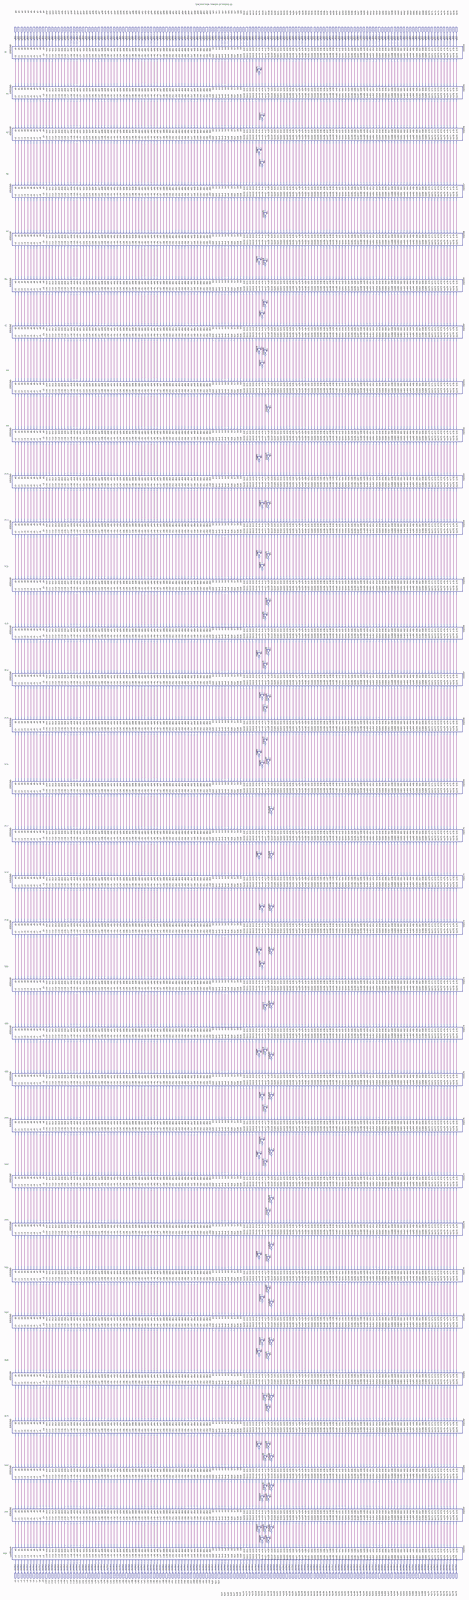
[diagram p0: schematic sheet, whole]
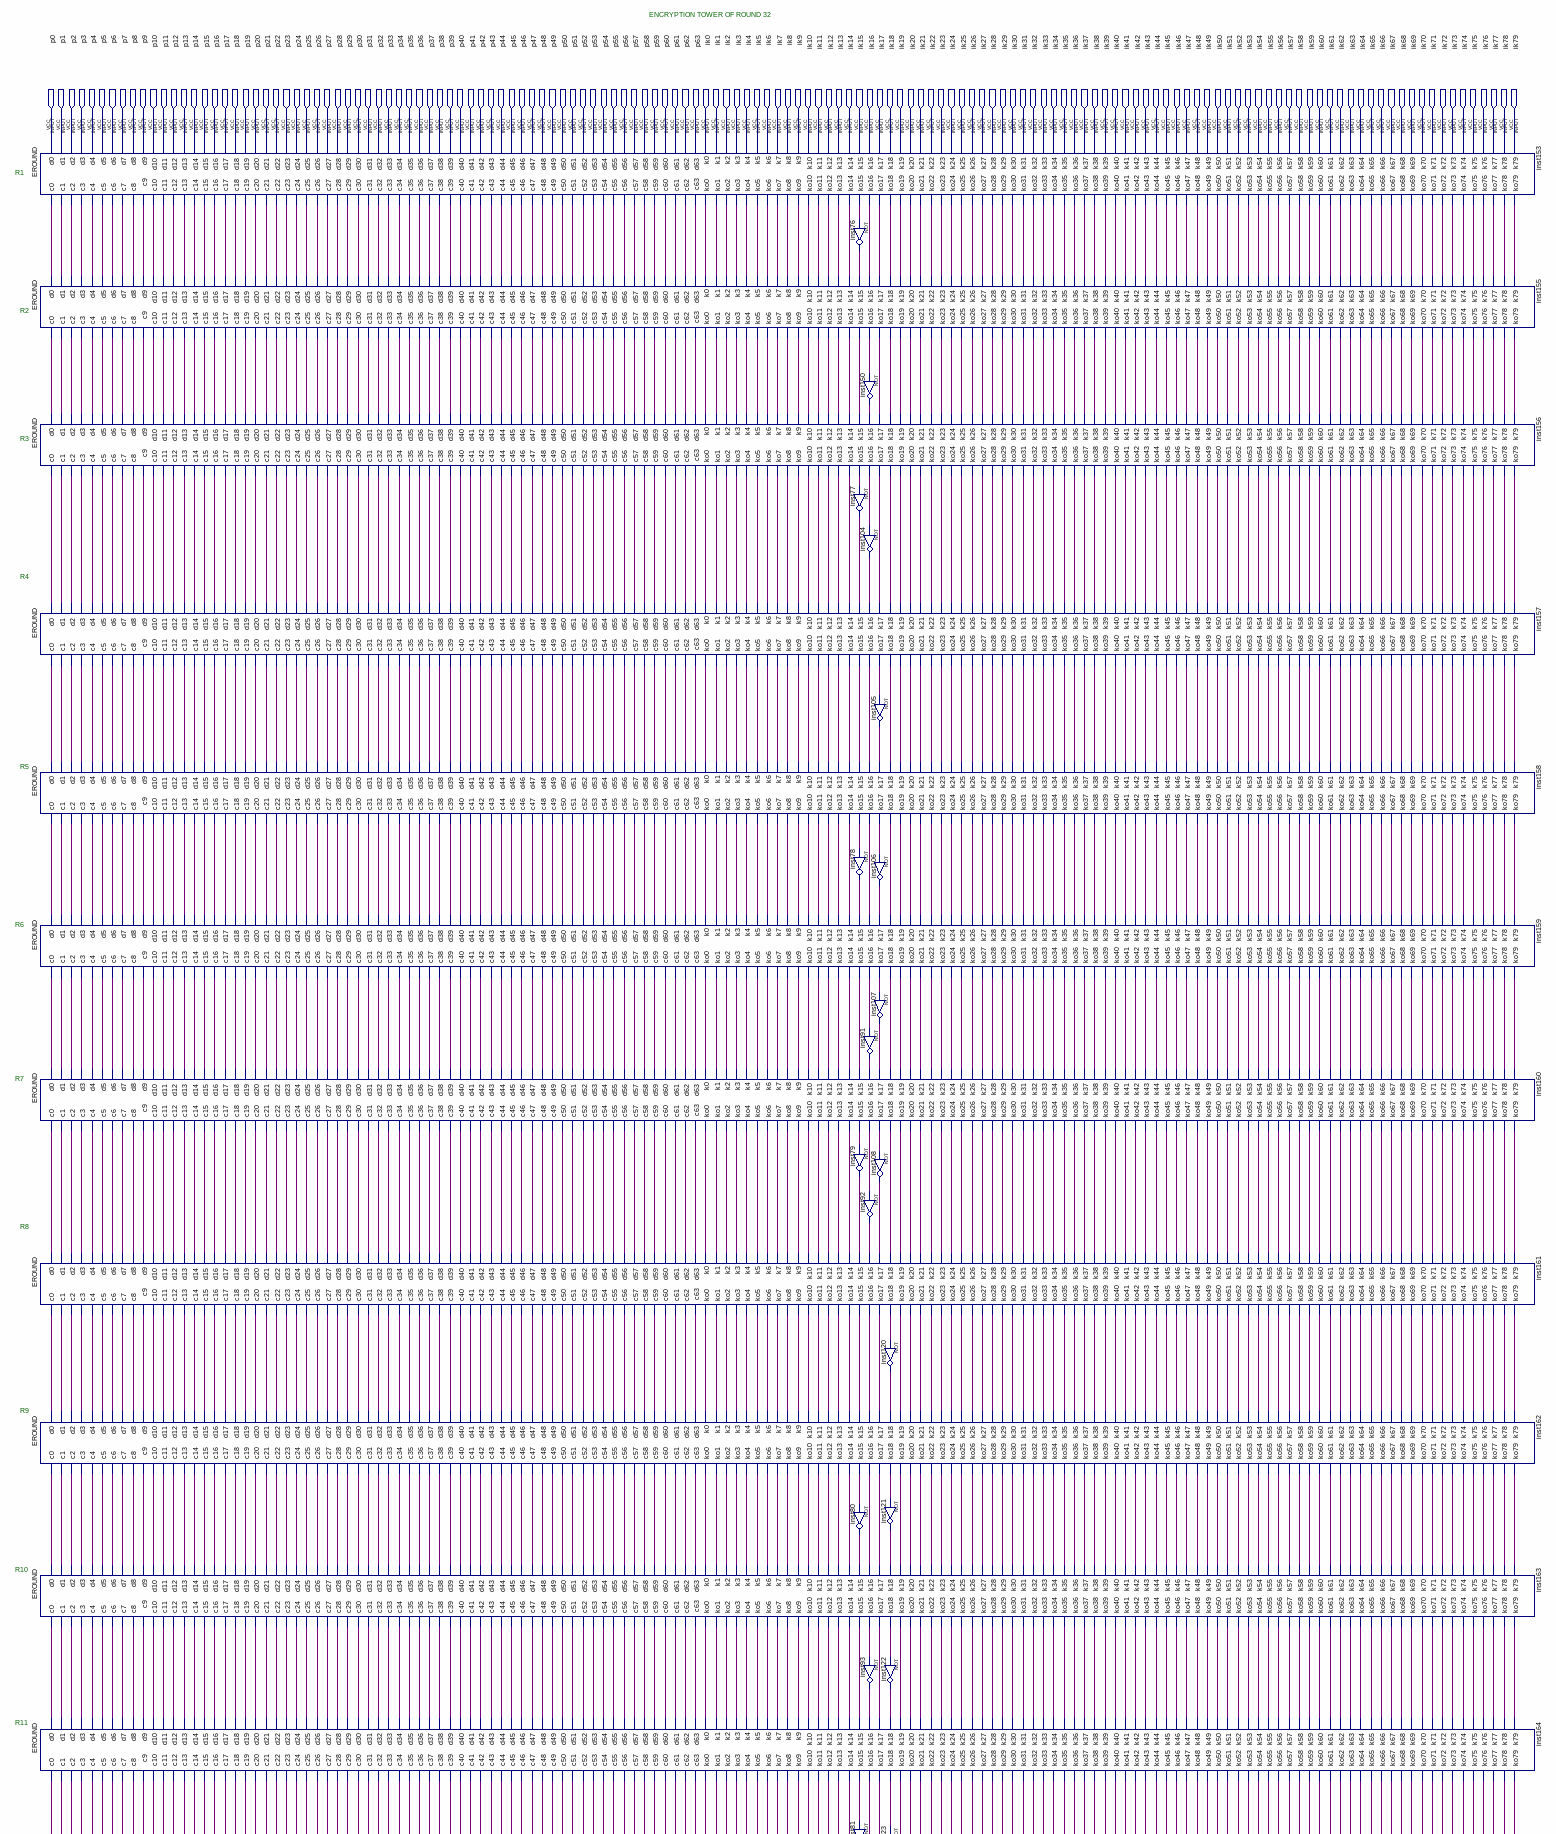
[diagram p1: schematic sheet, upper part]
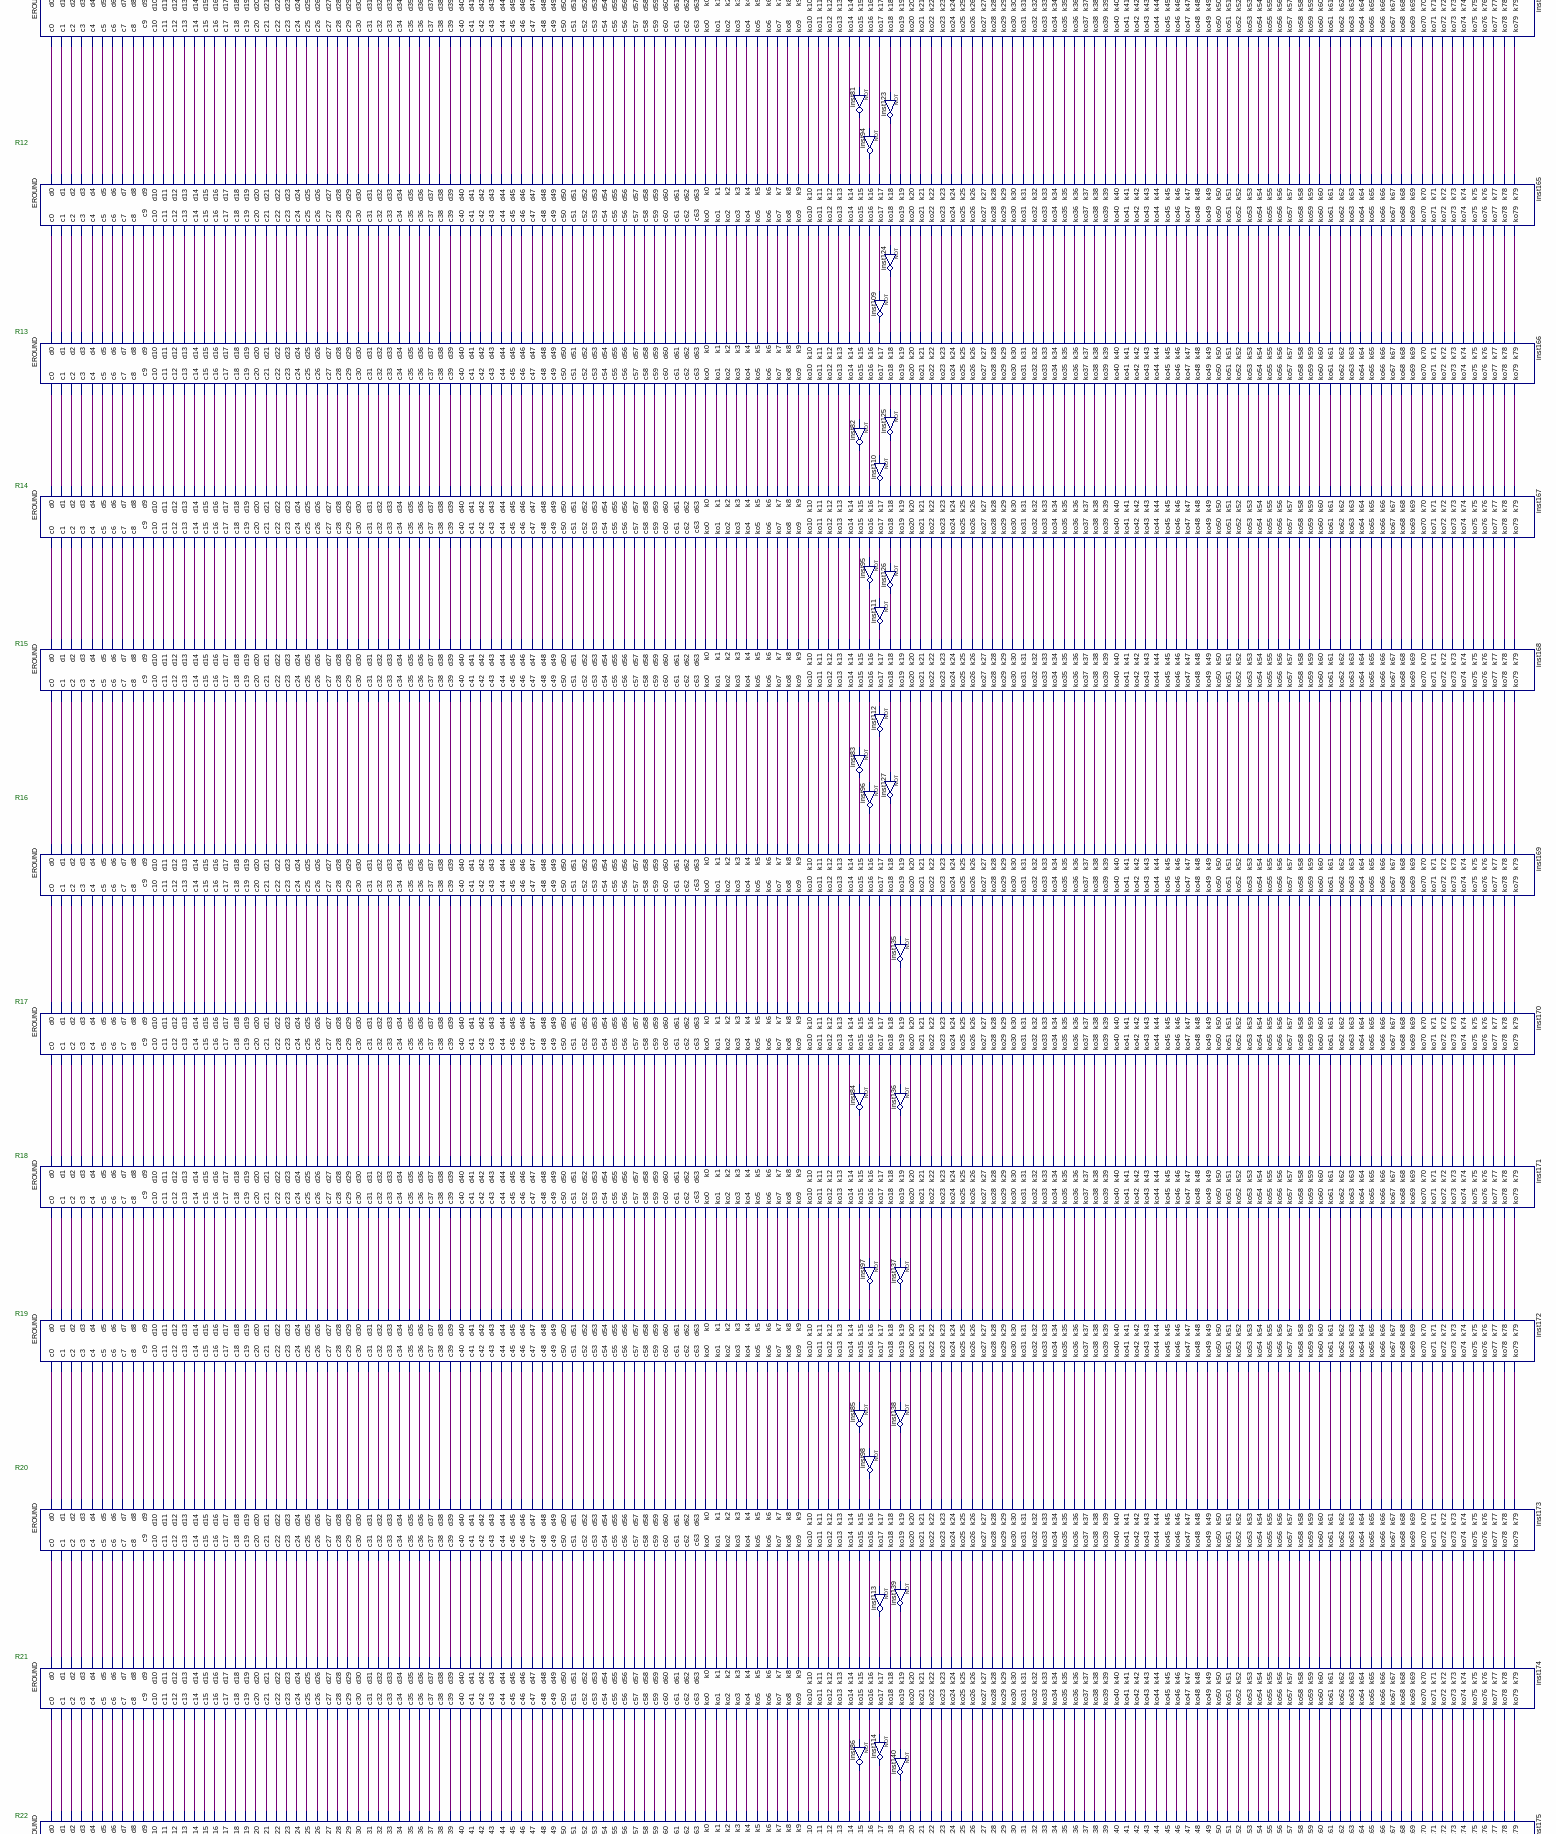
[diagram p2: schematic sheet, middle part]
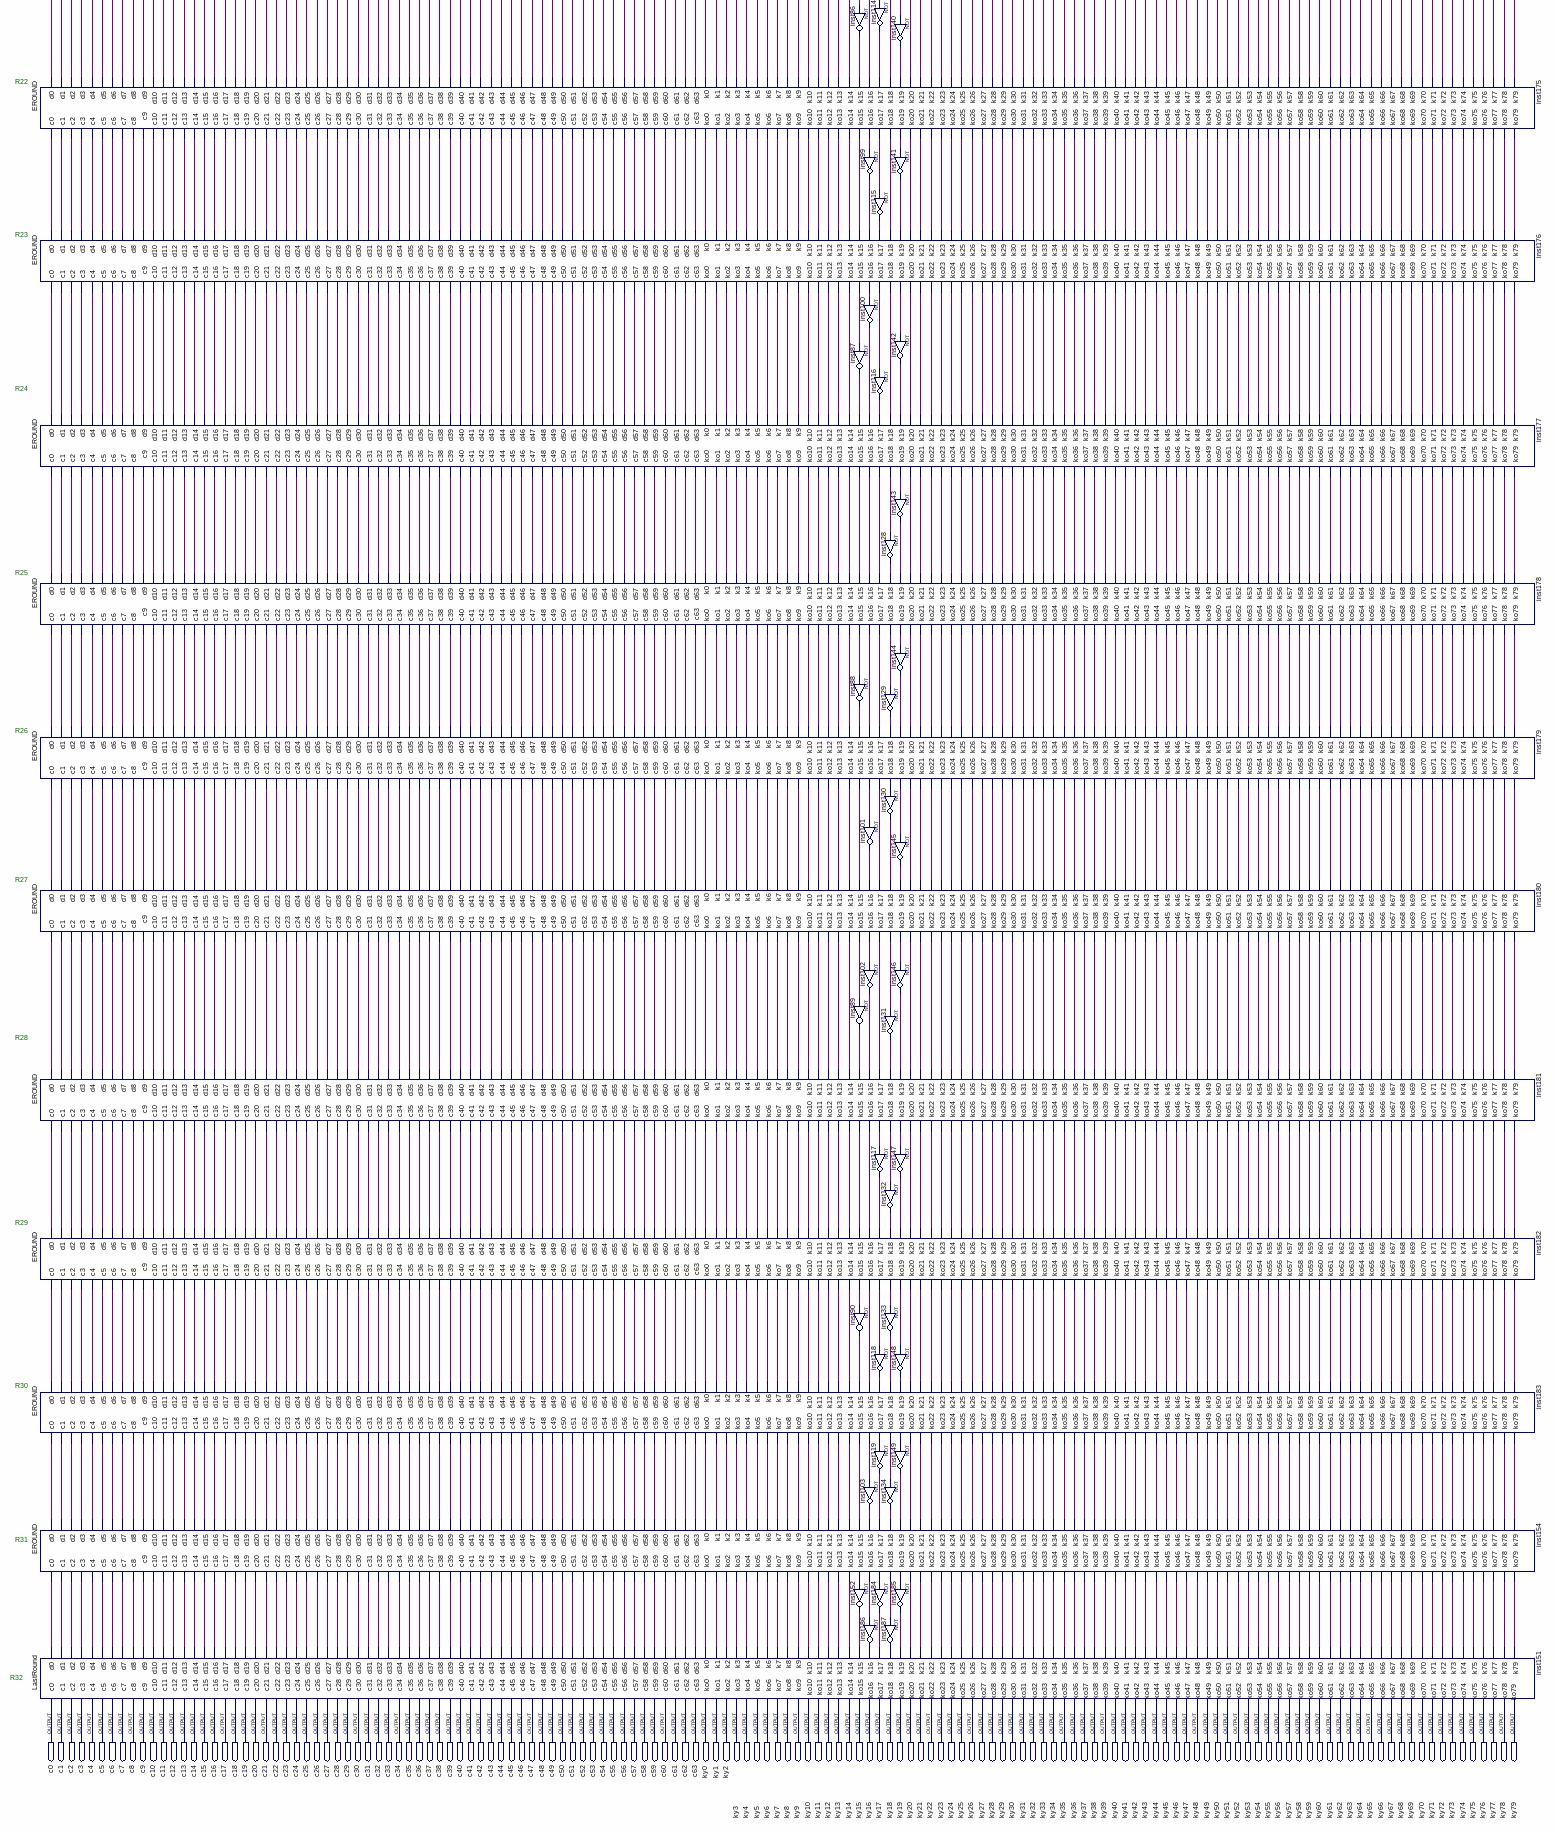
[diagram p3: schematic sheet, lower part]
// Quartus schematic PRESENT.bdf as structural Verilog: 112 symbols, 288 pins
module PRESENT (
  input  p0,
  input  p1,
  input  p2,
  input  p3,
  input  p4,
  input  p5,
  input  p6,
  input  p7,
  input  p8,
  input  p9,
  input  p10,
  input  p11,
  input  p12,
  input  p13,
  input  p14,
  input  p15,
  input  p16,
  input  p17,
  input  p18,
  input  p19,
  input  p20,
  input  p21,
  input  p22,
  input  p23,
  input  p24,
  input  p25,
  input  p26,
  input  p27,
  input  p28,
  input  p29,
  input  p30,
  input  p31,
  input  p32,
  input  p33,
  input  p34,
  input  p35,
  input  p36,
  input  p37,
  input  p38,
  input  p39,
  input  p40,
  input  p41,
  input  p42,
  input  p43,
  input  p44,
  input  p45,
  input  p46,
  input  p47,
  input  p48,
  input  p49,
  input  p50,
  input  p51,
  input  p52,
  input  p53,
  input  p54,
  input  p55,
  input  p56,
  input  p57,
  input  p58,
  input  p59,
  input  p60,
  input  p61,
  input  p62,
  input  p63,
  input  ik0,
  input  ik1,
  input  ik2,
  input  ik3,
  input  ik4,
  input  ik5,
  input  ik6,
  input  ik7,
  input  ik8,
  input  ik9,
  input  ik10,
  input  ik11,
  input  ik12,
  input  ik13,
  input  ik14,
  input  ik15,
  input  ik16,
  input  ik17,
  input  ik18,
  input  ik19,
  input  ik20,
  input  ik21,
  input  ik22,
  input  ik23,
  input  ik24,
  input  ik25,
  input  ik26,
  input  ik27,
  input  ik28,
  input  ik29,
  input  ik30,
  input  ik31,
  input  ik32,
  input  ik33,
  input  ik34,
  input  ik35,
  input  ik36,
  input  ik37,
  input  ik38,
  input  ik39,
  input  ik40,
  input  ik41,
  input  ik42,
  input  ik43,
  input  ik44,
  input  ik45,
  input  ik46,
  input  ik47,
  input  ik48,
  input  ik49,
  input  ik50,
  input  ik51,
  input  ik52,
  input  ik53,
  input  ik54,
  input  ik55,
  input  ik56,
  input  ik57,
  input  ik58,
  input  ik59,
  input  ik60,
  input  ik61,
  input  ik62,
  input  ik63,
  input  ik64,
  input  ik65,
  input  ik66,
  input  ik67,
  input  ik68,
  input  ik69,
  input  ik70,
  input  ik71,
  input  ik72,
  input  ik73,
  input  ik74,
  input  ik75,
  input  ik76,
  input  ik77,
  input  ik78,
  input  ik79,
  output c0,
  output c1,
  output c2,
  output c3,
  output c4,
  output c5,
  output c6,
  output c7,
  output c8,
  output c9,
  output c10,
  output c11,
  output c12,
  output c13,
  output c14,
  output c15,
  output c16,
  output c17,
  output c18,
  output c19,
  output c20,
  output c21,
  output c22,
  output c23,
  output c24,
  output c25,
  output c26,
  output c27,
  output c28,
  output c29,
  output c30,
  output c31,
  output c32,
  output c33,
  output c34,
  output c35,
  output c36,
  output c37,
  output c38,
  output c39,
  output c40,
  output c41,
  output c42,
  output c43,
  output c44,
  output c45,
  output c46,
  output c47,
  output c48,
  output c49,
  output c50,
  output c51,
  output c52,
  output c53,
  output c54,
  output c55,
  output c56,
  output c57,
  output c58,
  output c59,
  output c60,
  output c61,
  output c62,
  output c63,
  output ky0,
  output ky1,
  output ky2,
  output ky3,
  output ky4,
  output ky5,
  output ky6,
  output ky7,
  output ky8,
  output ky9,
  output ky10,
  output ky11,
  output ky12,
  output ky13,
  output ky14,
  output ky15,
  output ky16,
  output ky17,
  output ky18,
  output ky19,
  output ky20,
  output ky21,
  output ky22,
  output ky23,
  output ky24,
  output ky25,
  output ky26,
  output ky27,
  output ky28,
  output ky29,
  output ky30,
  output ky31,
  output ky32,
  output ky33,
  output ky34,
  output ky35,
  output ky36,
  output ky37,
  output ky38,
  output ky39,
  output ky40,
  output ky41,
  output ky42,
  output ky43,
  output ky44,
  output ky45,
  output ky46,
  output ky47,
  output ky48,
  output ky49,
  output ky50,
  output ky51,
  output ky52,
  output ky53,
  output ky54,
  output ky55,
  output ky56,
  output ky57,
  output ky58,
  output ky59,
  output ky60,
  output ky61,
  output ky62,
  output ky63,
  output ky64,
  output ky65,
  output ky66,
  output ky67,
  output ky68,
  output ky69,
  output ky70,
  output ky71,
  output ky72,
  output ky73,
  output ky74,
  output ky75,
  output ky76,
  output ky77,
  output ky78,
  output ky79
);
